# EAGLE design M8320D (EAGLE 6.6.0)
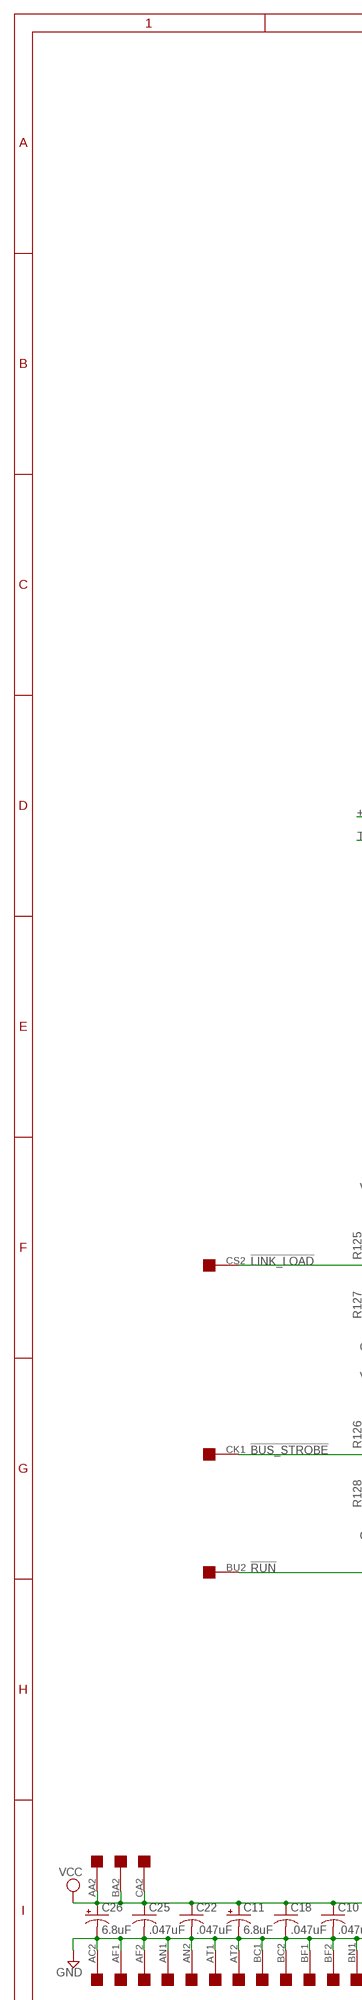
[diagram p0: schematic, sheet 1, part 1 of 2]
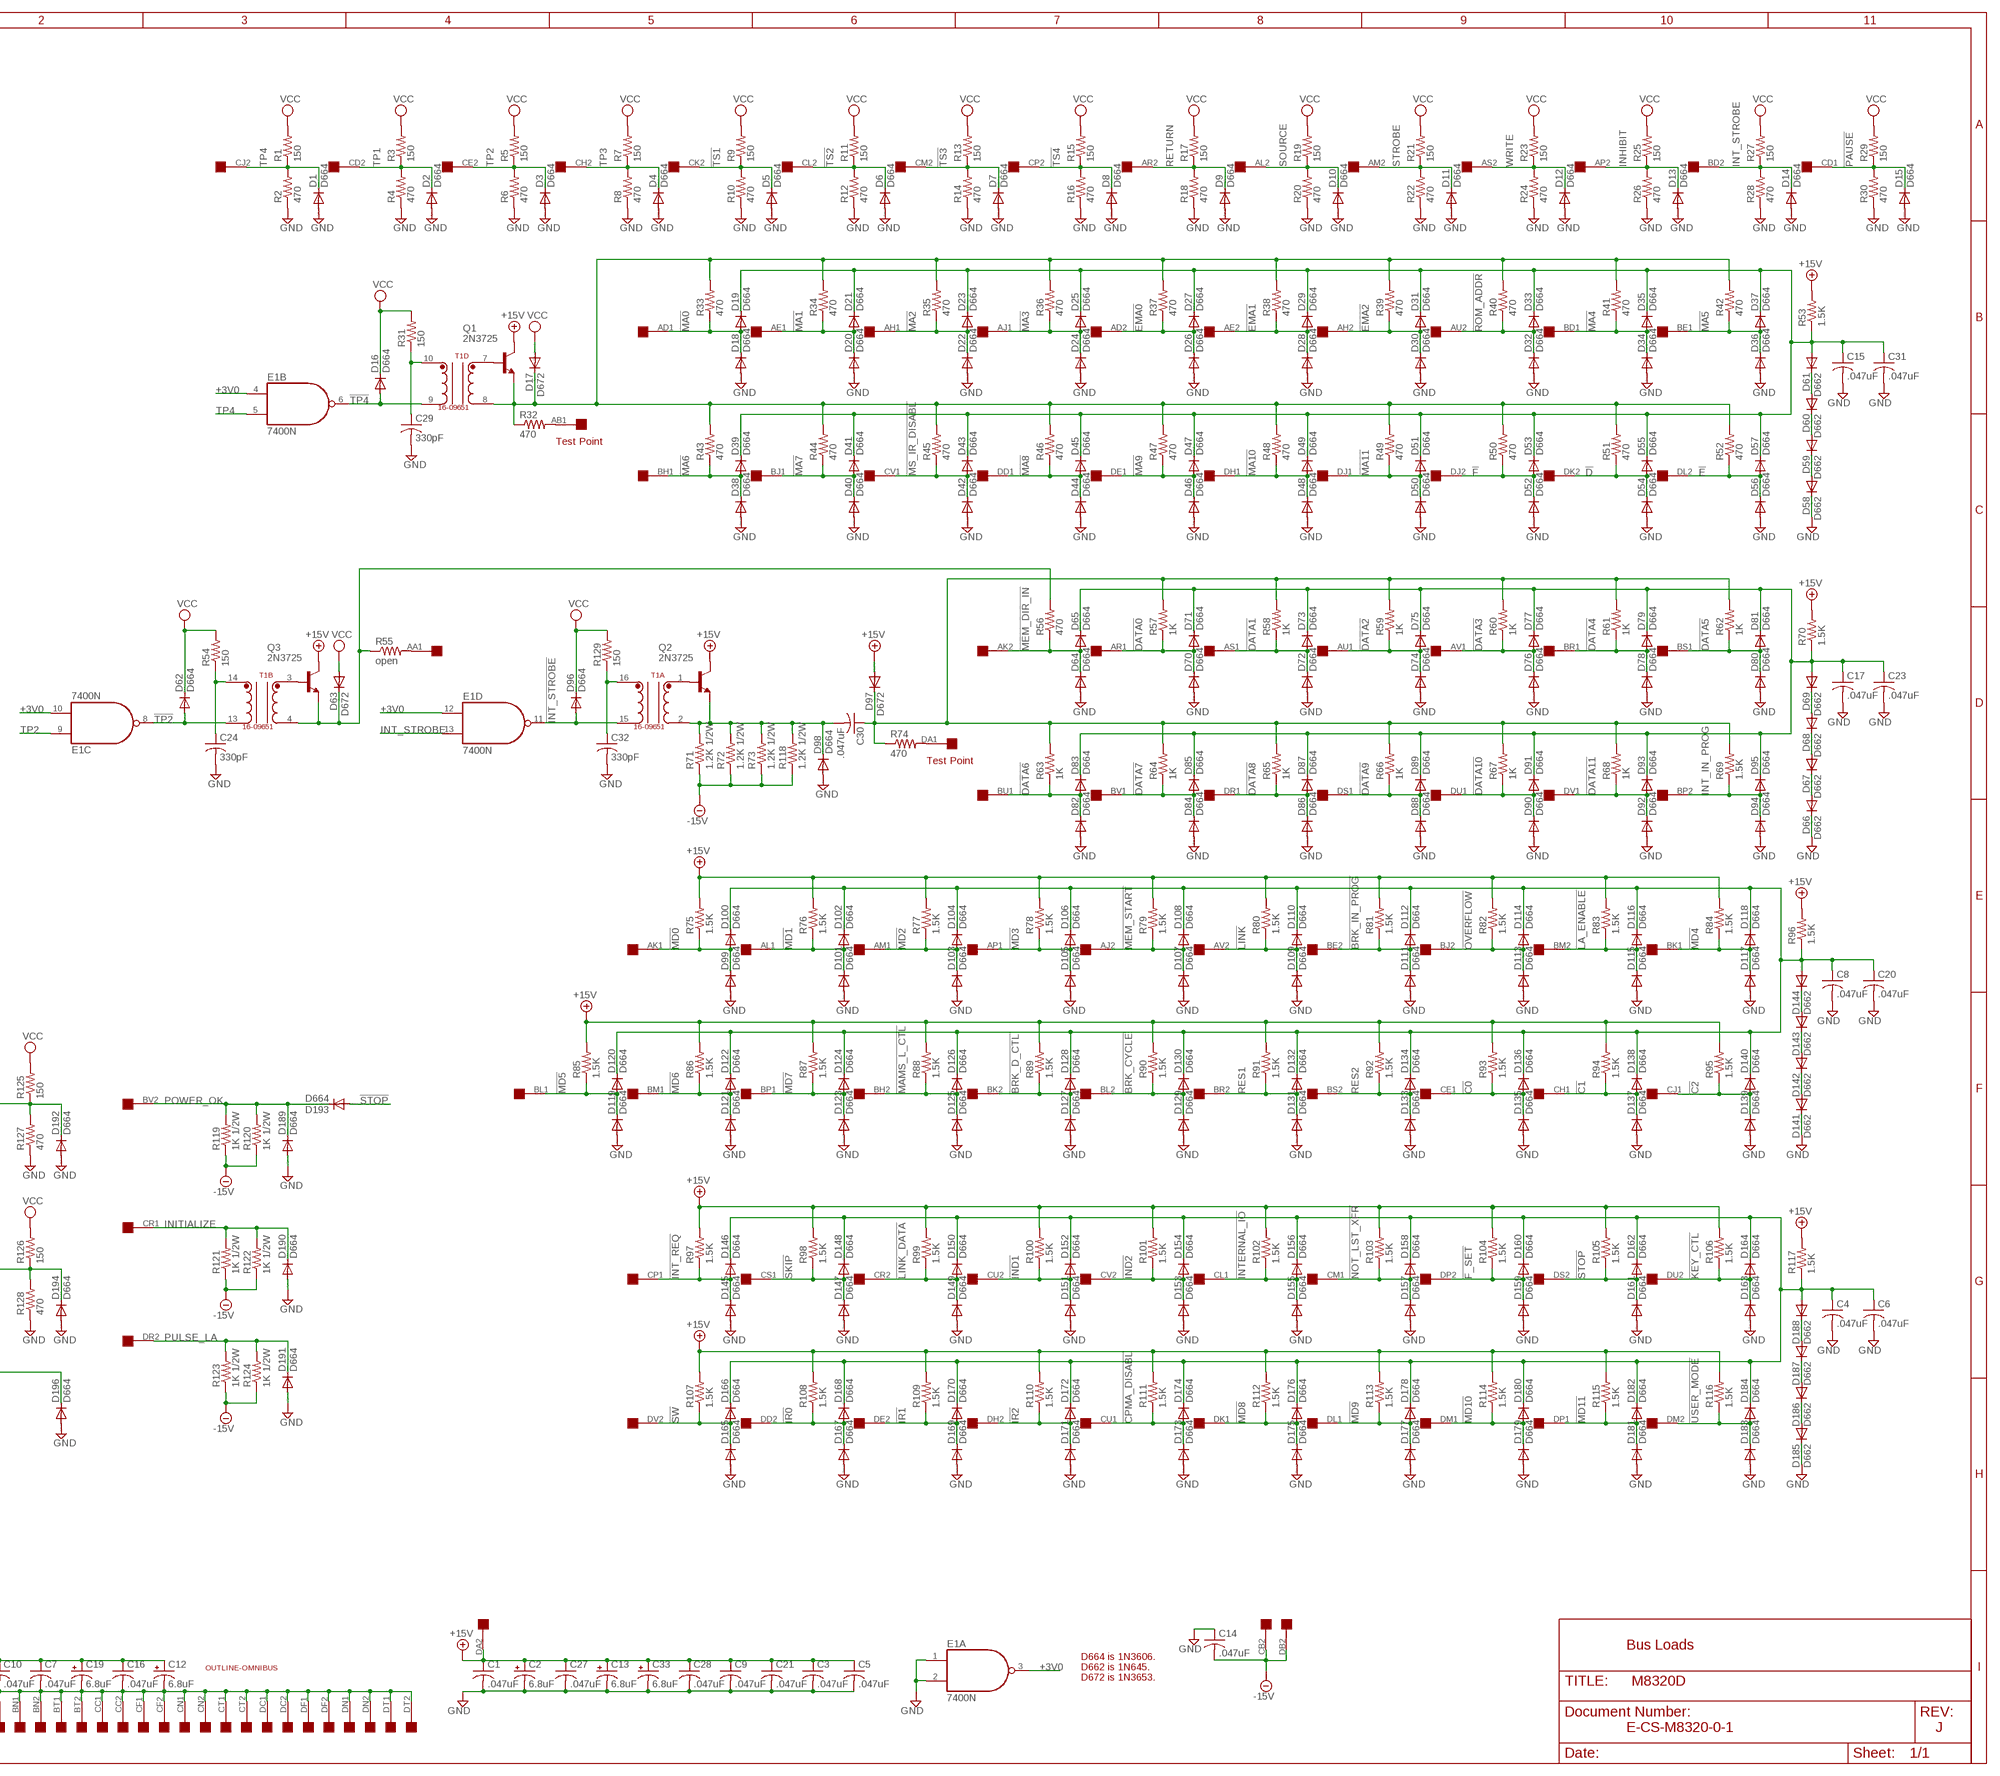
[diagram p1: schematic, sheet 1, part 2 of 2]

## Parts
C1  .047uF  C-US  [C063-025X075]
C2  6.8uF  CPOL-USE20-8AXIAL  [E12-8]
C3  .047uF  C-US  [C063-025X075]
C4  .047uF  C-US  [C063-025X075]
C5  .047uF  C-US  [C063-025X075]
C6  .047uF  C-US  [C063-025X075]
C7  .047uF  C-US  [C063-025X075]
C8  .047uF  C-US  [C063-025X075]
C9  .047uF  C-US  [C063-025X075]
C10  .047uF  C-US  [C063-025X075]
C11  6.8uF  CPOL-USE20-8AXIAL  [E12-8]
C12  6.8uF  CPOL-USE20-8AXIAL  [E12-8]
C13  6.8uF  CPOL-USE20-8AXIAL  [E12-8]
C14  .047uF  C-US  [C063-025X075]
C15  .047uF  C-US  [C063-025X075]
C16  .047uF  C-US  [C063-025X075]
C17  .047uF  C-US  [C063-025X075]
C18  .047uF  C-US  [C063-025X075]
C19  6.8uF  CPOL-USE20-8AXIAL  [E12-8]
C20  .047uF  C-US  [C063-025X075]
C21  .047uF  C-US  [C063-025X075]
C22  .047uF  C-US  [C063-025X075]
C23  .047uF  C-US  [C063-025X075]
C24  330pF  C-US  [C063-025X075]
C25  .047uF  C-US  [C063-025X075]
C26  6.8uF  CPOL-USE20-8AXIAL  [E12-8]
C27  .047uF  C-US  [C063-025X075]
C28  .047uF  C-US  [C063-025X075]
C29  330pF  C-US  [C063-025X075]
C30  .047uF  C-US  [C063-025X075]
C31  .047uF  C-US  [C063-025X075]
C32  330pF  C-US  [C063-025X075]
C33  6.8uF  CPOL-USE20-8AXIAL  [E12-8]
D1  D664  DIODE-DO35-10  [DO35-10]
D2  D664  DIODE-DO35-10  [DO35-10]
D3  D664  DIODE-DO35-10  [DO35-10]
D4  D664  DIODE-DO35-10  [DO35-10]
D5  D664  DIODE-DO35-10  [DO35-10]
D6  D664  DIODE-DO35-10  [DO35-10]
D7  D664  DIODE-DO35-10  [DO35-10]
D8  D664  DIODE-DO35-10  [DO35-10]
D9  D664  DIODE-DO35-10  [DO35-10]
D10  D664  DIODE-DO35-10  [DO35-10]
D11  D664  DIODE-DO35-10  [DO35-10]
D12  D664  DIODE-DO35-10  [DO35-10]
D13  D664  DIODE-DO35-10  [DO35-10]
D14  D664  DIODE-DO35-10  [DO35-10]
D15  D664  DIODE-DO35-10  [DO35-10]
D16  D664  DIODE-DO35-10  [DO35-10]
D17  D672  DIODE-DO35-10  [DO35-10]
D18  D664  DIODE-DO35-10  [DO35-10]
D19  D664  DIODE-DO35-10  [DO35-10]
D20  D664  DIODE-DO35-10  [DO35-10]
D21  D664  DIODE-DO35-10  [DO35-10]
D22  D664  DIODE-DO35-10  [DO35-10]
D23  D664  DIODE-DO35-10  [DO35-10]
D24  D664  DIODE-DO35-10  [DO35-10]
D25  D664  DIODE-DO35-10  [DO35-10]
D26  D664  DIODE-DO35-10  [DO35-10]
D27  D664  DIODE-DO35-10  [DO35-10]
D28  D664  DIODE-DO35-10  [DO35-10]
D29  D664  DIODE-DO35-10  [DO35-10]
D30  D664  DIODE-DO35-10  [DO35-10]
D31  D664  DIODE-DO35-10  [DO35-10]
D32  D664  DIODE-DO35-10  [DO35-10]
D33  D664  DIODE-DO35-10  [DO35-10]
D34  D664  DIODE-DO35-10  [DO35-10]
D35  D664  DIODE-DO35-10  [DO35-10]
D36  D664  DIODE-DO35-10  [DO35-10]
D37  D664  DIODE-DO35-10  [DO35-10]
D38  D664  DIODE-DO35-10  [DO35-10]
D39  D664  DIODE-DO35-10  [DO35-10]
D40  D664  DIODE-DO35-10  [DO35-10]
D41  D664  DIODE-DO35-10  [DO35-10]
D42  D664  DIODE-DO35-10  [DO35-10]
D43  D664  DIODE-DO35-10  [DO35-10]
D44  D664  DIODE-DO35-10  [DO35-10]
D45  D664  DIODE-DO35-10  [DO35-10]
D46  D664  DIODE-DO35-10  [DO35-10]
D47  D664  DIODE-DO35-10  [DO35-10]
D48  D664  DIODE-DO35-10  [DO35-10]
D49  D664  DIODE-DO35-10  [DO35-10]
D50  D664  DIODE-DO35-10  [DO35-10]
D51  D664  DIODE-DO35-10  [DO35-10]
D52  D664  DIODE-DO35-10  [DO35-10]
D53  D664  DIODE-DO35-10  [DO35-10]
D54  D664  DIODE-DO35-10  [DO35-10]
D55  D664  DIODE-DO35-10  [DO35-10]
D56  D664  DIODE-DO35-10  [DO35-10]
D57  D664  DIODE-DO35-10  [DO35-10]
D58  D662  DIODE-DO35-10  [DO35-10]
D59  D662  DIODE-DO35-10  [DO35-10]
D60  D662  DIODE-DO35-10  [DO35-10]
D61  D662  DIODE-DO35-10  [DO35-10]
D62  D664  DIODE-DO35-10  [DO35-10]
D63  D672  DIODE-DO35-10  [DO35-10]
D64  D664  DIODE-DO35-10  [DO35-10]
D65  D664  DIODE-DO35-10  [DO35-10]
D66  D662  DIODE-DO35-10  [DO35-10]
D67  D662  DIODE-DO35-10  [DO35-10]
D68  D662  DIODE-DO35-10  [DO35-10]
D69  D662  DIODE-DO35-10  [DO35-10]
D70  D664  DIODE-DO35-10  [DO35-10]
D71  D664  DIODE-DO35-10  [DO35-10]
D72  D664  DIODE-DO35-10  [DO35-10]
D73  D664  DIODE-DO35-10  [DO35-10]
D74  D664  DIODE-DO35-10  [DO35-10]
D75  D664  DIODE-DO35-10  [DO35-10]
D76  D664  DIODE-DO35-10  [DO35-10]
D77  D664  DIODE-DO35-10  [DO35-10]
D78  D664  DIODE-DO35-10  [DO35-10]
D79  D664  DIODE-DO35-10  [DO35-10]
D80  D664  DIODE-DO35-10  [DO35-10]
D81  D664  DIODE-DO35-10  [DO35-10]
D82  D664  DIODE-DO35-10  [DO35-10]
D83  D664  DIODE-DO35-10  [DO35-10]
D84  D664  DIODE-DO35-10  [DO35-10]
D85  D664  DIODE-DO35-10  [DO35-10]
D86  D664  DIODE-DO35-10  [DO35-10]
D87  D664  DIODE-DO35-10  [DO35-10]
D88  D664  DIODE-DO35-10  [DO35-10]
D89  D664  DIODE-DO35-10  [DO35-10]
D90  D664  DIODE-DO35-10  [DO35-10]
D91  D664  DIODE-DO35-10  [DO35-10]
D92  D664  DIODE-DO35-10  [DO35-10]
D93  D664  DIODE-DO35-10  [DO35-10]
D94  D664  DIODE-DO35-10  [DO35-10]
D95  D664  DIODE-DO35-10  [DO35-10]
D96  D664  DIODE-DO35-10  [DO35-10]
D97  D672  DIODE-DO35-10  [DO35-10]
D98  D664  DIODE-DO35-10  [DO35-10]
D99  D664  DIODE-DO35-10  [DO35-10]
D100  D664  DIODE-DO35-10  [DO35-10]
D101  D664  DIODE-DO35-10  [DO35-10]
D102  D664  DIODE-DO35-10  [DO35-10]
D103  D664  DIODE-DO35-10  [DO35-10]
D104  D664  DIODE-DO35-10  [DO35-10]
D105  D664  DIODE-DO35-10  [DO35-10]
D106  D664  DIODE-DO35-10  [DO35-10]
D107  D664  DIODE-DO35-10  [DO35-10]
D108  D664  DIODE-DO35-10  [DO35-10]
D109  D664  DIODE-DO35-10  [DO35-10]
D110  D664  DIODE-DO35-10  [DO35-10]
D111  D664  DIODE-DO35-10  [DO35-10]
D112  D664  DIODE-DO35-10  [DO35-10]
D113  D664  DIODE-DO35-10  [DO35-10]
D114  D664  DIODE-DO35-10  [DO35-10]
D115  D664  DIODE-DO35-10  [DO35-10]
D116  D664  DIODE-DO35-10  [DO35-10]
D117  D664  DIODE-DO35-10  [DO35-10]
D118  D664  DIODE-DO35-10  [DO35-10]
D119  D664  DIODE-DO35-10  [DO35-10]
D120  D664  DIODE-DO35-10  [DO35-10]
D121  D664  DIODE-DO35-10  [DO35-10]
D122  D664  DIODE-DO35-10  [DO35-10]
D123  D664  DIODE-DO35-10  [DO35-10]
D124  D664  DIODE-DO35-10  [DO35-10]
D125  D664  DIODE-DO35-10  [DO35-10]
D126  D664  DIODE-DO35-10  [DO35-10]
D127  D664  DIODE-DO35-10  [DO35-10]
D128  D664  DIODE-DO35-10  [DO35-10]
D129  D664  DIODE-DO35-10  [DO35-10]
D130  D664  DIODE-DO35-10  [DO35-10]
D131  D664  DIODE-DO35-10  [DO35-10]
D132  D664  DIODE-DO35-10  [DO35-10]
D133  D664  DIODE-DO35-10  [DO35-10]
D134  D664  DIODE-DO35-10  [DO35-10]
D135  D664  DIODE-DO35-10  [DO35-10]
D136  D664  DIODE-DO35-10  [DO35-10]
D137  D664  DIODE-DO35-10  [DO35-10]
D138  D664  DIODE-DO35-10  [DO35-10]
D139  D664  DIODE-DO35-10  [DO35-10]
D140  D664  DIODE-DO35-10  [DO35-10]
D141  D662  DIODE-DO35-10  [DO35-10]
D142  D662  DIODE-DO35-10  [DO35-10]
D143  D662  DIODE-DO35-10  [DO35-10]
D144  D662  DIODE-DO35-10  [DO35-10]
D145  D664  DIODE-DO35-10  [DO35-10]
D146  D664  DIODE-DO35-10  [DO35-10]
D147  D664  DIODE-DO35-10  [DO35-10]
D148  D664  DIODE-DO35-10  [DO35-10]
D149  D664  DIODE-DO35-10  [DO35-10]
D150  D664  DIODE-DO35-10  [DO35-10]
D151  D664  DIODE-DO35-10  [DO35-10]
D152  D664  DIODE-DO35-10  [DO35-10]
D153  D664  DIODE-DO35-10  [DO35-10]
D154  D664  DIODE-DO35-10  [DO35-10]
D155  D664  DIODE-DO35-10  [DO35-10]
D156  D664  DIODE-DO35-10  [DO35-10]
D157  D664  DIODE-DO35-10  [DO35-10]
D158  D664  DIODE-DO35-10  [DO35-10]
D159  D664  DIODE-DO35-10  [DO35-10]
D160  D664  DIODE-DO35-10  [DO35-10]
D161  D664  DIODE-DO35-10  [DO35-10]
D162  D664  DIODE-DO35-10  [DO35-10]
D163  D664  DIODE-DO35-10  [DO35-10]
D164  D664  DIODE-DO35-10  [DO35-10]
D165  D664  DIODE-DO35-10  [DO35-10]
D166  D664  DIODE-DO35-10  [DO35-10]
D167  D664  DIODE-DO35-10  [DO35-10]
D168  D664  DIODE-DO35-10  [DO35-10]
D169  D664  DIODE-DO35-10  [DO35-10]
D170  D664  DIODE-DO35-10  [DO35-10]
D171  D664  DIODE-DO35-10  [DO35-10]
D172  D664  DIODE-DO35-10  [DO35-10]
D173  D664  DIODE-DO35-10  [DO35-10]
D174  D664  DIODE-DO35-10  [DO35-10]
D175  D664  DIODE-DO35-10  [DO35-10]
D176  D664  DIODE-DO35-10  [DO35-10]
D177  D664  DIODE-DO35-10  [DO35-10]
D178  D664  DIODE-DO35-10  [DO35-10]
D179  D664  DIODE-DO35-10  [DO35-10]
D180  D664  DIODE-DO35-10  [DO35-10]
D181  D664  DIODE-DO35-10  [DO35-10]
D182  D664  DIODE-DO35-10  [DO35-10]
D183  D664  DIODE-DO35-10  [DO35-10]
D184  D664  DIODE-DO35-10  [DO35-10]
D185  D662  DIODE-DO35-10  [DO35-10]
D186  D662  DIODE-DO35-10  [DO35-10]
D187  D662  DIODE-DO35-10  [DO35-10]
D188  D662  DIODE-DO35-10  [DO35-10]
D189  D664  DIODE-DO35-10  [DO35-10]
D190  D664  DIODE-DO35-10  [DO35-10]
D191  D664  DIODE-DO35-10  [DO35-10]
D192  D664  DIODE-DO35-10  [DO35-10]
D193  D664  DIODE-DO35-10  [DO35-10]
D194  D664  DIODE-DO35-10  [DO35-10]
D196  D664  DIODE-DO35-10  [DO35-10]
E1  7400N  [DIL14]
Q1  2N3725  -NPN-TO92-EBC  [TO92-EBC]
Q2  2N3725  -NPN-TO92-EBC  [TO92-EBC]
Q3  2N3725  -NPN-TO92-EBC  [TO92-EBC]
R1  150  R-US_0207/10  [0207/10]
R2  470  R-US_0207/10  [0207/10]
R3  150  R-US_0207/10  [0207/10]
R4  470  R-US_0207/10  [0207/10]
R5  150  R-US_0207/10  [0207/10]
R6  470  R-US_0207/10  [0207/10]
R7  150  R-US_0207/10  [0207/10]
R8  470  R-US_0207/10  [0207/10]
R9  150  R-US_0207/10  [0207/10]
R10  470  R-US_0207/10  [0207/10]
R11  150  R-US_0207/10  [0207/10]
R12  470  R-US_0207/10  [0207/10]
R13  150  R-US_0207/10  [0207/10]
R14  470  R-US_0207/10  [0207/10]
R15  150  R-US_0207/10  [0207/10]
R16  470  R-US_0207/10  [0207/10]
R17  150  R-US_0207/10  [0207/10]
R18  470  R-US_0207/10  [0207/10]
R19  150  R-US_0207/10  [0207/10]
R20  470  R-US_0207/10  [0207/10]
R21  150  R-US_0207/10  [0207/10]
R22  470  R-US_0207/10  [0207/10]
R23  150  R-US_0207/10  [0207/10]
R24  470  R-US_0207/10  [0207/10]
R25  150  R-US_0207/10  [0207/10]
R26  470  R-US_0207/10  [0207/10]
R27  150  R-US_0207/10  [0207/10]
R28  470  R-US_0207/10  [0207/10]
R29  150  R-US_0207/10  [0207/10]
R30  470  R-US_0207/10  [0207/10]
R31  150  R-US_0207/10  [0207/10]
R32  470  R-US_0207/10  [0207/10]
R33  470  R-US_0207/10  [0207/10]
R34  470  R-US_0207/10  [0207/10]
R35  470  R-US_0207/10  [0207/10]
R36  470  R-US_0207/10  [0207/10]
R37  470  R-US_0207/10  [0207/10]
R38  470  R-US_0207/10  [0207/10]
R39  470  R-US_0207/10  [0207/10]
R40  470  R-US_0207/10  [0207/10]
R41  470  R-US_0207/10  [0207/10]
R42  470  R-US_0207/10  [0207/10]
R43  470  R-US_0207/10  [0207/10]
R44  470  R-US_0207/10  [0207/10]
R45  470  R-US_0207/10  [0207/10]
R46  470  R-US_0207/10  [0207/10]
R47  470  R-US_0207/10  [0207/10]
R48  470  R-US_0207/10  [0207/10]
R49  470  R-US_0207/10  [0207/10]
R50  470  R-US_0207/10  [0207/10]
R51  470  R-US_0207/10  [0207/10]
R52  470  R-US_0207/10  [0207/10]
R53  1.5K  R-US_0207/10  [0207/10]
R54  150  R-US_0207/10  [0207/10]
R55  open  R-US_0207/10  [0207/10]
R56  470  R-US_0207/10  [0207/10]
R57  1K  R-US_0207/10  [0207/10]
R58  1K  R-US_0207/10  [0207/10]
R59  1K  R-US_0207/10  [0207/10]
R60  1K  R-US_0207/10  [0207/10]
R61  1K  R-US_0207/10  [0207/10]
R62  1K  R-US_0207/10  [0207/10]
R63  1K  R-US_0207/10  [0207/10]
R64  1K  R-US_0207/10  [0207/10]
R65  1K  R-US_0207/10  [0207/10]
R66  1K  R-US_0207/10  [0207/10]
R67  1K  R-US_0207/10  [0207/10]
R68  1K  R-US_0207/10  [0207/10]
R69  1.5K  R-US_0207/10  [0207/10]
R70  1.5K  R-US_0207/10  [0207/10]
R71  1.2K 1/2W  R-US_0411/15  [0411/15]
R72  1.2K 1/2W  R-US_0411/15  [0411/15]
R73  1.2K 1/2W  R-US_0411/15  [0411/15]
R74  470  R-US_0207/10  [0207/10]
R75  1.5K  R-US_0207/10  [0207/10]
R76  1.5K  R-US_0207/10  [0207/10]
R77  1.5K  R-US_0207/10  [0207/10]
R78  1.5K  R-US_0207/10  [0207/10]
R79  1.5K  R-US_0207/10  [0207/10]
R80  1.5K  R-US_0207/10  [0207/10]
R81  1.5K  R-US_0207/10  [0207/10]
R82  1.5K  R-US_0207/10  [0207/10]
R83  1.5K  R-US_0207/10  [0207/10]
R84  1.5K  R-US_0207/10  [0207/10]
R85  1.5K  R-US_0207/10  [0207/10]
R86  1.5K  R-US_0207/10  [0207/10]
R87  1.5K  R-US_0207/10  [0207/10]
R88  1.5K  R-US_0207/10  [0207/10]
R89  1.5K  R-US_0207/10  [0207/10]
R90  1.5K  R-US_0207/10  [0207/10]
R91  1.5K  R-US_0207/10  [0207/10]
R92  1.5K  R-US_0207/10  [0207/10]
R93  1.5K  R-US_0207/10  [0207/10]
R94  1.5K  R-US_0207/10  [0207/10]
R95  1.5K  R-US_0207/10  [0207/10]
R96  1.5K  R-US_0207/10  [0207/10]
R97  1.5K  R-US_0207/10  [0207/10]
R98  1.5K  R-US_0207/10  [0207/10]
R99  1.5K  R-US_0207/10  [0207/10]
R100  1.5K  R-US_0207/10  [0207/10]
R101  1.5K  R-US_0207/10  [0207/10]
R102  1.5K  R-US_0207/10  [0207/10]
R103  1.5K  R-US_0207/10  [0207/10]
R104  1.5K  R-US_0207/10  [0207/10]
R105  1.5K  R-US_0207/10  [0207/10]
R106  1.5K  R-US_0207/10  [0207/10]
R107  1.5K  R-US_0207/10  [0207/10]
R108  1.5K  R-US_0207/10  [0207/10]
R109  1.5K  R-US_0207/10  [0207/10]
R110  1.5K  R-US_0207/10  [0207/10]
R111  1.5K  R-US_0207/10  [0207/10]
R112  1.5K  R-US_0207/10  [0207/10]
R113  1.5K  R-US_0207/10  [0207/10]
R114  1.5K  R-US_0207/10  [0207/10]
R115  1.5K  R-US_0207/10  [0207/10]
R116  1.5K  R-US_0207/10  [0207/10]
R117  1.5K  R-US_0207/10  [0207/10]
R118  1.2K 1/2W  R-US_0411/15  [0411/15]
R119  1K 1/2W  R-US_0411/15  [0411/15]
R120  1K 1/2W  R-US_0411/15  [0411/15]
R121  1K 1/2W  R-US_0411/15  [0411/15]
R122  1K 1/2W  R-US_0411/15  [0411/15]
R123  1K 1/2W  R-US_0411/15  [0411/15]
R124  1K 1/2W  R-US_0411/15  [0411/15]
R125  150  R-US_0207/10  [0207/10]
R126  150  R-US_0207/10  [0207/10]
R127  470  R-US_0207/10  [0207/10]
R128  470  R-US_0207/10  [0207/10]
R129  150  R-US_0207/10  [0207/10]
T1  16-09651  [DIL16]
U$1  OUTLINE-OMNIBUS  [OMNIBUS]
U$2  QUAD  [EDGE-CON8]

## Nets
!BRK_CYCLE: D129.C D130.A R90.1 U$2.BL2
!BRK_D_CTL: D127.C D128.A R89.1 U$2.BK2
!BRK_IN_PROG: D111.C D112.A R81.1 U$2.BE2
!BUS_STROBE: D194.C R126.1 R128.2 U$2.CK1
!C0: D135.C D136.A R93.1 U$2.CE1
!C1: D137.C D138.A R94.1 U$2.CH1
!C2: D139.C D140.A R95.1 U$2.CJ1
!CPMA_DISABL: D173.C D174.A R111.1 U$2.CU1
!D: D54.C D55.A R51.1 U$2.DK2
!DATA0: D70.C D71.A R57.1 U$2.AR1
!DATA1: D72.C D73.A R58.1 U$2.AS1
!DATA2: D74.C D75.A R59.1 U$2.AU1
!DATA3: D76.C D77.A R60.1 U$2.AV1
!DATA4: D78.C D79.A R61.1 U$2.BR1
!DATA5: D80.C D81.A R62.1 U$2.BS1
!DATA6: D82.C D83.A R63.1 U$2.BU1
!DATA7: D84.C D85.A R64.1 U$2.BV1
!DATA8: D86.C D87.A R65.1 U$2.DR1
!DATA9: D88.C D89.A R66.1 U$2.DS1
!DATA10: D90.C D91.A R67.1 U$2.DU1
!DATA11: D92.C D93.A R68.1 U$2.DV1
!E: D56.C D57.A R52.1 U$2.DL2
!EMA0: D26.C D27.A R37.1 U$2.AD2
!EMA1: D28.C D29.A R38.1 U$2.AE2
!EMA2: D30.C D31.A R39.1 U$2.AH2
!F: D52.C D53.A R50.1 U$2.DJ2
!F_SET: D159.C D160.A R104.1 U$2.DP2
!IND1: D151.C D152.A R100.1 U$2.CU2
!IND2: D153.C D154.A R101.1 U$2.CV2
!INT_REQ: D145.C D146.A R97.1 U$2.CP1
!INT_STROBE: D96.A E1.11(D:O) T1.15
!INTERNAL_IO: D155.C D156.A R102.1 U$2.CL1
!IR0: D167.C D168.A R108.1 U$2.DD2
!IR1: D169.C D170.A R109.1 U$2.DE2
!IR2: D171.C D172.A R110.1 U$2.DH2
!KEY_CTL: D163.C D164.A R106.1 U$2.DU2
!LA_ENABLE: D115.C D116.A R83.1 U$2.BM2
!LINK: D109.C D110.A R80.1 U$2.AV2
!LINK_DATA: D149.C D150.A R99.1 U$2.CR2
!LINK_LOAD: D192.C R125.1 R127.2 U$2.CS2
!MA0: D18.C D19.A R33.1 U$2.AD1
!MA1: D20.C D21.A R34.1 U$2.AE1
!MA2: D22.C D23.A R35.1 U$2.AH1
!MA3: D24.C D25.A R36.1 U$2.AJ1
!MA4: D34.C D35.A R41.1 U$2.BD1
!MA5: D36.C D37.A R42.1 U$2.BE1
!MA6: D38.C D39.A R43.1 U$2.BH1
!MA7: D40.C D41.A R44.1 U$2.BJ1
!MA8: D44.C D45.A R46.1 U$2.DD1
!MA9: D46.C D47.A R47.1 U$2.DE1
!MA10: D48.C D49.A R48.1 U$2.DH1
!MA11: D50.C D51.A R49.1 U$2.DJ1
!MAMS_L_CTL: D125.C D126.A R88.1 U$2.BH2
!MD0: D99.C D100.A R75.1 U$2.AK1
!MD1: D101.C D102.A R76.1 U$2.AL1
!MD2: D103.C D104.A R77.1 U$2.AM1
!MD3: D105.C D106.A R78.1 U$2.AP1
!MD4: D117.C D118.A R84.1 U$2.BK1
!MD5: D119.C D120.A R85.1 U$2.BL1
!MD6: D121.C D122.A R86.1 U$2.BM1
!MD7: D123.C D124.A R87.1 U$2.BP1
!MD8: D175.C D176.A R112.1 U$2.DK1
!MD9: D177.C D178.A R113.1 U$2.DL1
!MD10: D179.C D180.A R114.1 U$2.DM1
!MD11: D181.C D182.A R115.1 U$2.DP1
!MEM_DIR_IN: D64.C D65.A R56.1 U$2.AK2
!MEM_START: D107.C D108.A R79.1 U$2.AJ2
!MS_IR_DISABL: D42.C D43.A R45.1 U$2.CV1
!NOT_LST_XFR: D157.C D158.A R103.1 U$2.CM1
!OVERFLOW: D113.C D114.A R82.1 U$2.BJ2
!PAUSE: D15.C R29.1 R30.2 U$2.CD1
!ROM_ADDR: D32.C D33.A R40.1 U$2.AU2
!RUN: D196.C U$2.BU2
!SKIP: D147.C D148.A R98.1 U$2.CS1
!STOP: D161.C D162.A D193.A R105.1 U$2.DS2
!SW: D165.C D166.A R107.1 U$2.DV2
!TP2: D62.A E1.8(C:O) T1.13
!TP4: D16.A E1.6(B:O) T1.9
!TS1: D5.C R9.1 R10.2 U$2.CK2
!TS2: D6.C R11.1 R12.2 U$2.CL2
!TS3: D7.C R13.1 R14.2 U$2.CM2
!TS4: D8.C R15.1 R16.2 U$2.CP2
!USER_MODE: D183.C D184.A R116.1 U$2.DM2
+3V0: E1.3(A:O) E1.4(B:I0) E1.10(C:I1) E1.12(D:I0)
+15V: C1.1 C2.+ C3.1 C5.1 C9.1 C13.+ C21.1 C27.1 C28.1 C33.+ D97.A Q1.C Q2.C Q3.C R53.2 R70.2 R75.2 R76.2 R77.2 R78.2 R79.2 R80.2 R81.2 R82.2 R83.2 R84.2 R85.2 R86.2 R87.2 R88.2 R89.2 R90.2 R91.2 R92.2 R93.2 R94.2 R95.2 R96.2 R97.2 R98.2 R99.2 R100.2 R101.2 R102.2 R103.2 R104.2 R105.2 R106.2 R107.2 R108.2 R109.2 R110.2 R111.2 R112.2 R113.2 R114.2 R115.2 R116.2 R117.2 U$2.DA2
-15V: C14.2 R71.1 R72.1 R73.1 R118.1 R119.1 R120.1 R121.1 R122.1 R123.1 R124.1 U$2.CB2 U$2.DB2
GND: C1.2 C2.- C3.2 C4.2 C5.2 C6.2 C7.2 C8.2 C9.2 C10.2 C11.- C12.- C13.- C14.1 C15.2 C16.2 C17.2 C18.2 C19.- C20.2 C21.2 C22.2 C23.2 C24.2 C25.2 C26.- C27.2 C28.2 C29.2 C31.2 C32.2 C33.- D1.A D2.A D3.A D4.A D5.A D6.A D7.A D8.A D9.A D10.A D11.A D12.A D13.A D14.A D15.A D18.A D20.A D22.A D24.A D26.A D28.A D30.A D32.A D34.A D36.A D38.A D40.A D42.A D44.A D46.A D48.A D50.A D52.A D54.A D56.A D58.C D64.A D66.C D70.A D72.A D74.A D76.A D78.A D80.A D82.A D84.A D86.A D88.A D90.A D92.A D94.A D98.A D99.A D101.A D103.A D105.A D107.A D109.A D111.A D113.A D115.A D117.A D119.A D121.A D123.A D125.A D127.A D129.A D131.A D133.A D135.A D137.A D139.A D141.C D145.A D147.A D149.A D151.A D153.A D155.A D157.A D159.A D161.A D163.A D165.A D167.A D169.A D171.A D173.A D175.A D177.A D179.A D181.A D183.A D185.C D189.A D190.A D191.A D192.A D194.A D196.A E1.1(A:I0) E1.2(A:I1) R2.1 R4.1 R6.1 R8.1 R10.1 R12.1 R14.1 R16.1 R18.1 R20.1 R22.1 R24.1 R26.1 R28.1 R30.1 R127.1 R128.1 U$2.AC2 U$2.AF1 U$2.AF2 U$2.AN1 U$2.AN2 U$2.AT1 U$2.AT2 U$2.BC1 U$2.BC2 U$2.BF1 U$2.BF2 U$2.BN1 U$2.BN2 U$2.BT1 U$2.BT2 U$2.CC1 U$2.CC2 U$2.CF1 U$2.CF2 U$2.CN1 U$2.CN2 U$2.CT1 U$2.CT2 U$2.DC1 U$2.DC2 U$2.DF1 U$2.DF2 U$2.DN1 U$2.DN2 U$2.DT1 U$2.DT2
INHIBIT: D13.C R25.1 R26.2 U$2.AP2
INITIALIZE: D190.C R121.2 R122.2 U$2.CR1
INT_IN_PROG: D94.C D95.A R69.1 U$2.BP2
INT_STROBE: D14.C E1.13(D:I1) R27.1 R28.2 U$2.BD2
N$1: D58.A D59.C
N$2: D59.A D60.C
N$3: D60.A D61.C
N$4: C24.1 R54.1 T1.14
N$5: Q3.B T1.3
N$6: C30.1 D97.C R57.2 R58.2 R59.2 R60.2 R61.2 R62.2 R63.2 R64.2 R65.2 R66.2 R67.2 R68.2 R69.2 R74.1
N$7: C32.1 R129.1 T1.16
N$8: Q2.B T1.1
N$9: C15.1 C31.1 D19.C D21.C D23.C D25.C D27.C D29.C D31.C D33.C D35.C D37.C D39.C D41.C D43.C D45.C D47.C D49.C D51.C D53.C D55.C D57.C D61.A R53.1
N$10: D66.A D67.C
N$11: D67.A D68.C
N$12: D68.A D69.C
N$13: C17.1 C23.1 D65.C D69.A D71.C D73.C D75.C D77.C D79.C D81.C D83.C D85.C D87.C D89.C D91.C D93.C D95.C R70.1
N$14: C30.2 D98.C Q2.E R71.2 R72.2 R73.2 R118.2 T1.2
N$15: D63.C Q3.E R55.1 R56.2 T1.4
N$16: R74.2 U$2.DA1
N$17: D185.A D186.C
N$18: D141.A D142.C
N$19: D142.A D143.C
N$20: D143.A D144.C
N$21: C29.1 R31.1 T1.10
N$22: Q1.B T1.7
N$23: D17.C Q1.E R32.1 R33.2 R34.2 R35.2 R36.2 R37.2 R38.2 R39.2 R40.2 R41.2 R42.2 R43.2 R44.2 R45.2 R46.2 R47.2 R48.2 R49.2 R50.2 R51.2 R52.2 T1.8
N$24: R32.2 U$2.AB1
N$25: C8.1 C20.1 D100.C D102.C D104.C D106.C D108.C D110.C D112.C D114.C D116.C D118.C D120.C D122.C D124.C D126.C D128.C D130.C D132.C D134.C D136.C D138.C D140.C D144.A R96.1
N$26: D186.A D187.C
N$27: D187.A D188.C
N$28: C4.1 C6.1 D146.C D148.C D150.C D152.C D154.C D156.C D158.C D160.C D162.C D164.C D166.C D168.C D170.C D172.C D174.C D176.C D178.C D180.C D182.C D184.C D188.A R117.1
N$35: R55.2 U$2.AA1
POWER_OK: D189.C D193.C R119.2 R120.2 U$2.BV2
PULSE_LA: D191.C R123.2 R124.2 U$2.DR2
RES1: D131.C D132.A R91.1 U$2.BR2
RES2: D133.C D134.A R92.1 U$2.BS2
RETURN: D9.C R17.1 R18.2 U$2.AR2
SOURCE: D10.C R19.1 R20.2 U$2.AL2
STROBE: D11.C R21.1 R22.2 U$2.AM2
TP1: D2.C R3.1 R4.2 U$2.CD2
TP2: D3.C E1.9(C:I0) R5.1 R6.2 U$2.CE2
TP3: D4.C R7.1 R8.2 U$2.CH2
TP4: D1.C E1.5(B:I1) R1.1 R2.2 U$2.CJ2
VCC: C7.1 C10.1 C11.+ C12.+ C16.1 C18.1 C19.+ C22.1 C25.1 C26.+ D16.C D17.A D62.C D63.A D96.C R1.2 R3.2 R5.2 R7.2 R9.2 R11.2 R13.2 R15.2 R17.2 R19.2 R21.2 R23.2 R25.2 R27.2 R29.2 R31.2 R54.2 R125.2 R126.2 R129.2 U$2.AA2 U$2.BA2 U$2.CA2
WRITE: D12.C R23.1 R24.2 U$2.AS2
Unconnected: T1.5 T1.6 T1.11 T1.12 U$2.AB2 U$2.AC1 U$2.BA1 U$2.BB1 U$2.BB2 U$2.CA1 U$2.CB1 U$2.DB1

## Notes on the sheet
- Test Point
- Test Point
- Bus Loads
- D664 is 1N3606.
- D662 is 1N645.
- D672 is 1N3653.
- E-CS-M8320-0-1 | J

## Power pins joined to a net without a drawn wire
GND: E1.7(P:GND)
VCC: E1.14(P:VCC)

## Library data of the parts
C1 C3-C10 C14-C18 C20-C25 C27-C32 = dec-con:C-US: Capacitors with funky DEC lead spacing.
C2 C11-C13 C19 C26 C33 = dec-con:CPOL-USE20-8AXIAL: A 0.8 inch electrolytic.
D1-D194 D196 = diode:DIODE-: DIODE
E1 = 74xx-us:74*00: Quad 2-input NAND gate
Q1-Q3 = transistor:*-NPN-: NPN Transistror BF959 corrected 2008.03.06
R1-R129 = rcl:R-US_: RESISTOR, American symbol
T1 = dec-con:16-09651: DIP-16 Quad Pulse Transformer
U$1 = dec-con:OUTLINE-*: Board outlines for DEC boards.
U$2 = dec-con:QUAD: Quad-Height DEC board

## Board
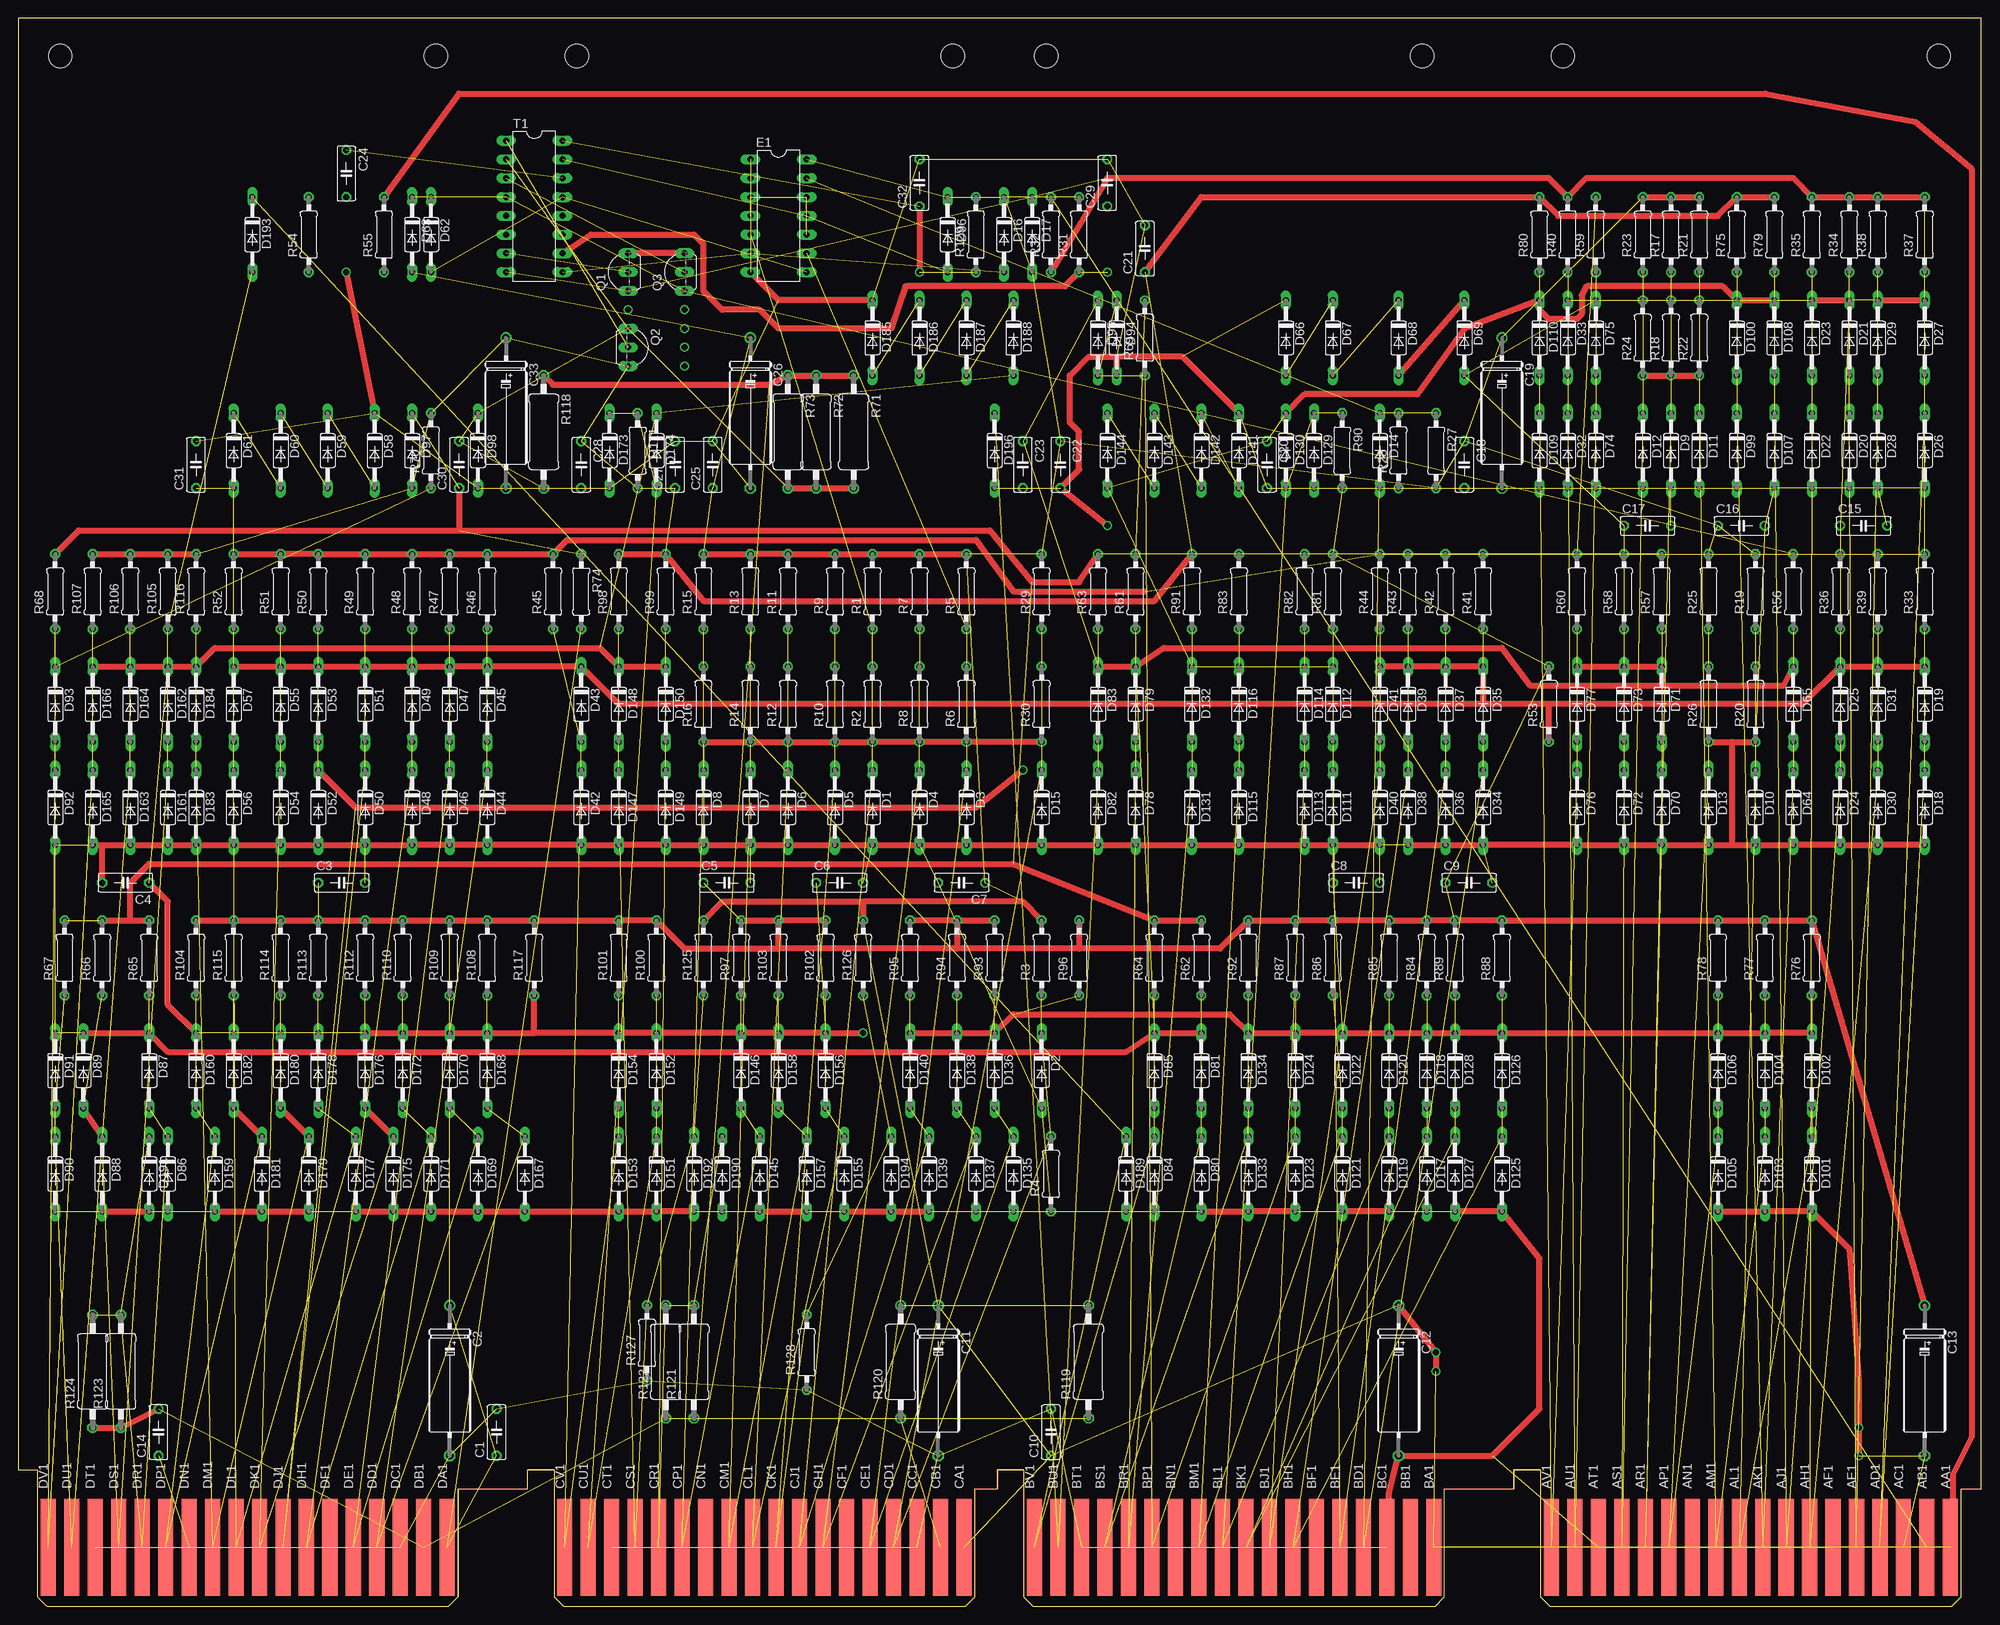
[diagram p2: board, top side]
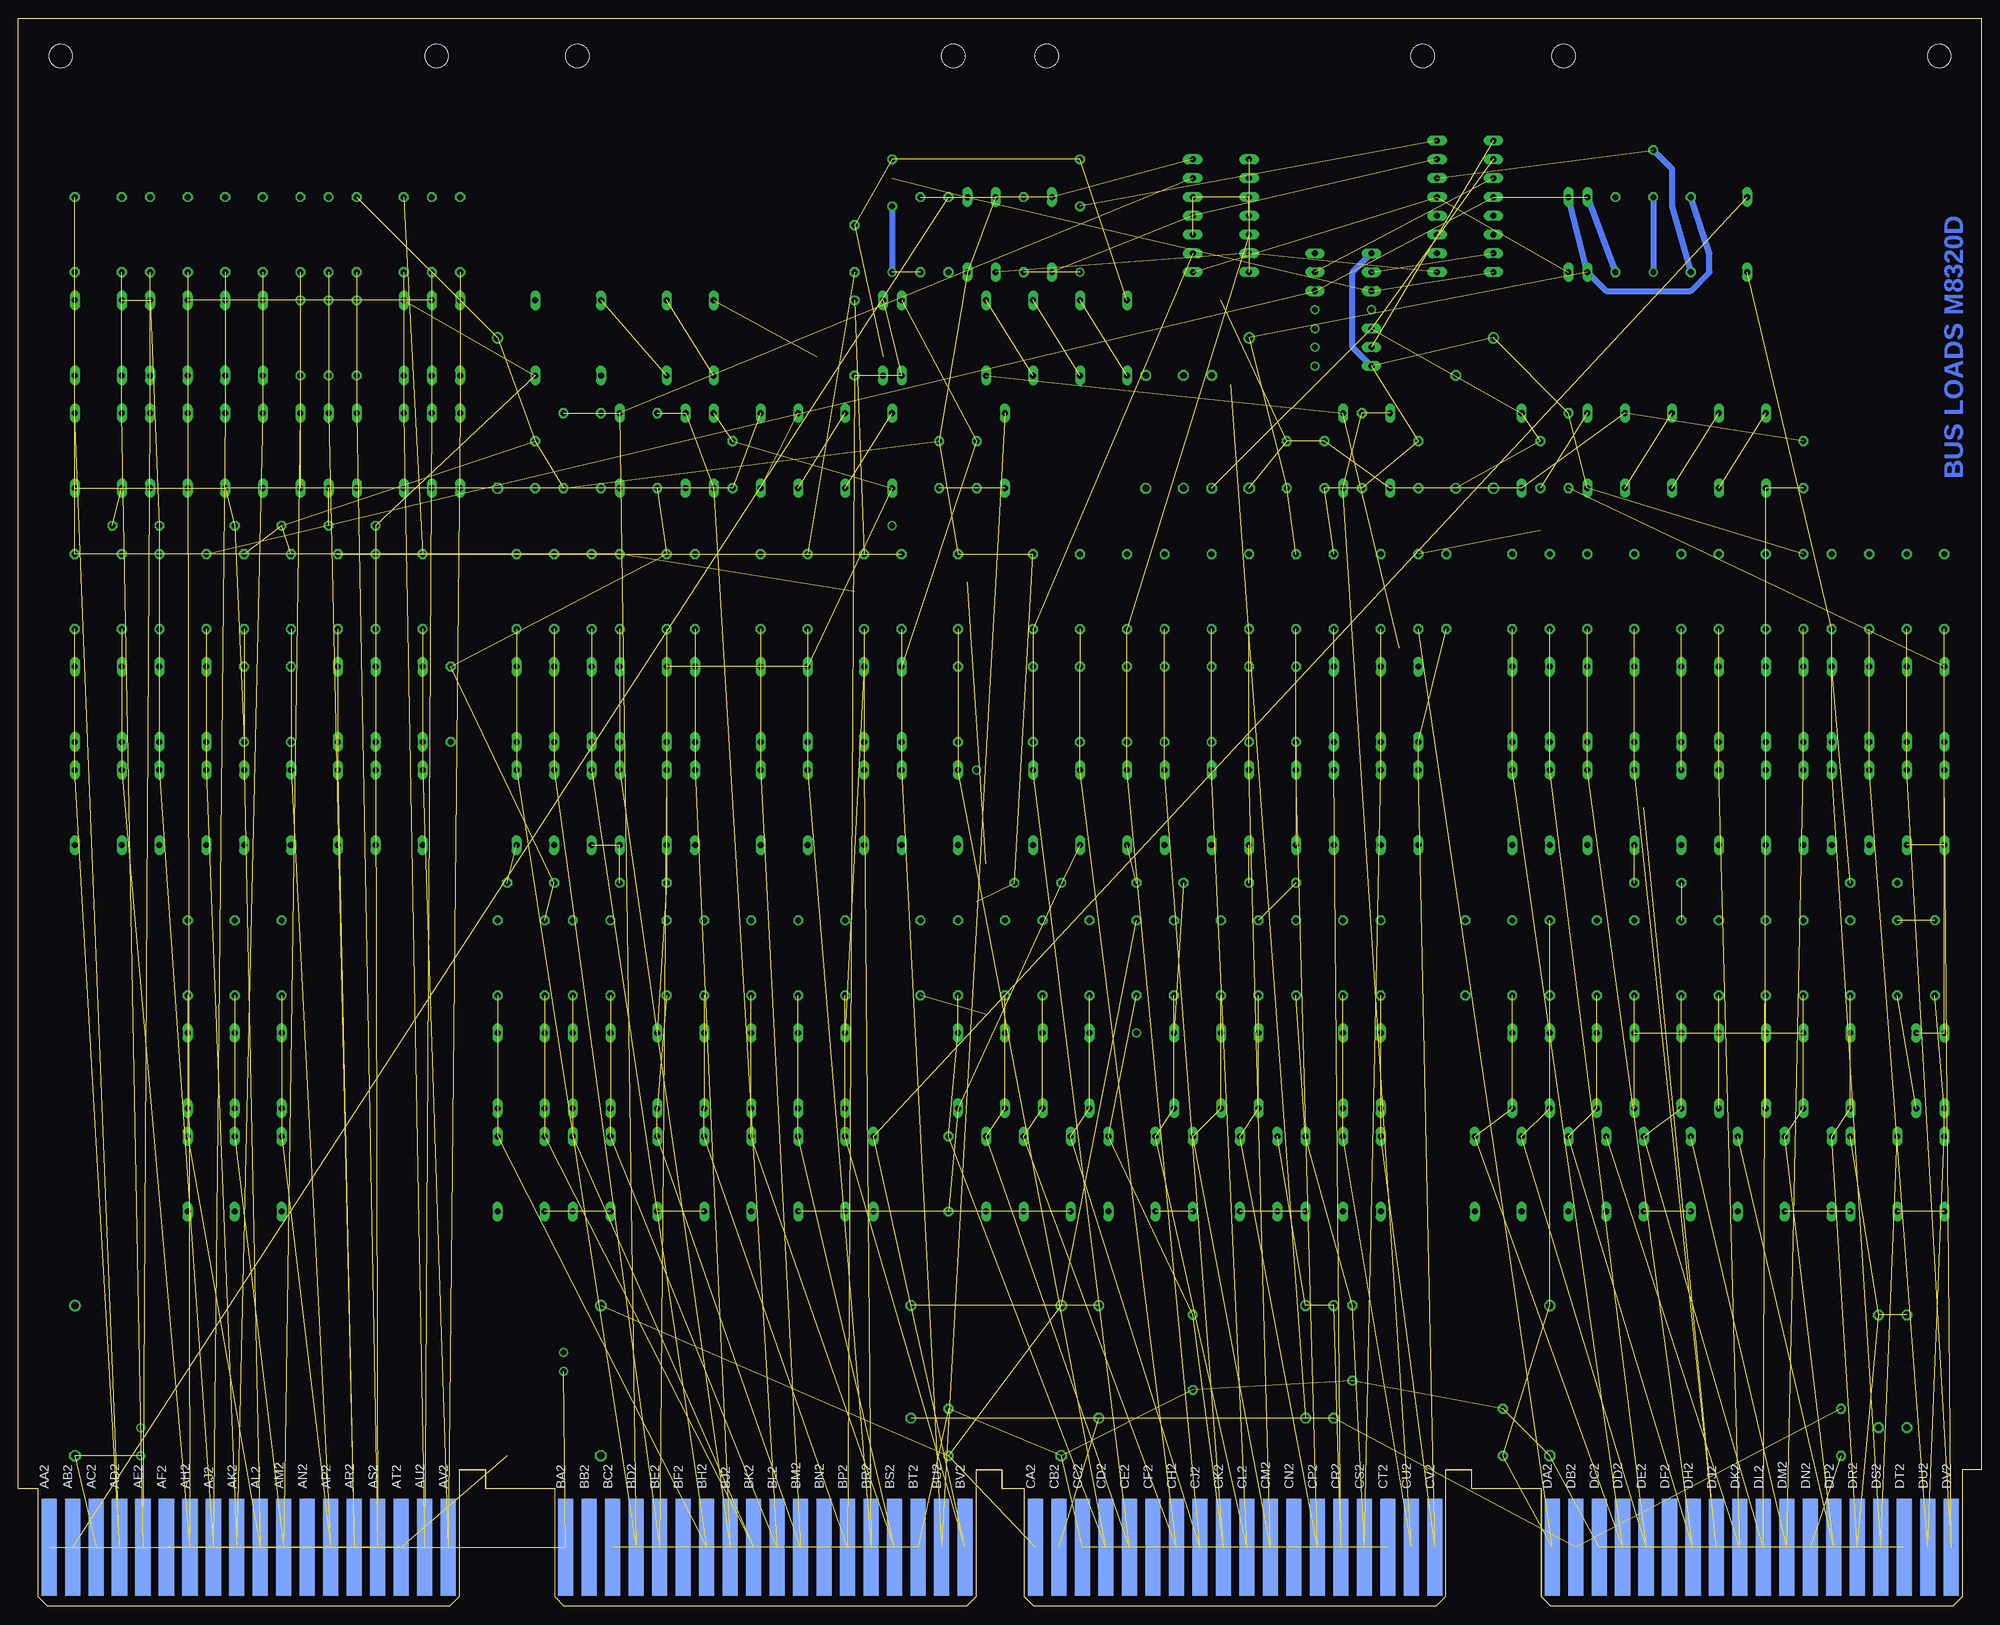
[diagram p3: board, bottom side, seen from below]

Size 265.3 x 214.63 mm. Coordinates in mm from the lower left corner, seen from the top.
Copper layers (1+16): Top 0.035mm / dielectric 1.5mm / Bottom 0.035mm
Design rules "16mils": minimum track width 16mil, minimum drill 32mil, track to track 15mil, track to pad 10mil, pad to pad 10mil, via to via 10mil, smd to smd 10mil, copper to edge 13mil, drill to drill 10mil, minimum pad ring 10mil, minimum via ring 8mil, stop-mask expansion 0mil, vias tented up to drill 0mil, thermal gap 10mil

### Footprints (pad centres in the part's own frame; a part is rotated, then mirrored left to right if it is on the bottom)
C063-025X075 = drill 0.813 octagon: 1 -2.54,0; 2 3.81,0
E12-8 = drill 1.016: + -10.16,0 | drill 1.016 octagon: - 10.16,0
DO35-10 = drill 0.813 long: A 5.08,0; C -5.08,0
DIL14 = drill 0.813 long: 1 -7.62,-3.81; 2 -5.08,-3.81; 3 -2.54,-3.81; 4 0,-3.81; 5 2.54,-3.81; 6 5.08,-3.81; 7 7.62,-3.81; 8 7.62,3.81; 9 5.08,3.81; 10 2.54,3.81; 11 0,3.81; 12 -2.54,3.81; 13 -5.08,3.81; 14 -7.62,3.81
TO92-EBC = drill 0.813 long: B 0,-1.27; C 2.54,-1.27; E -2.54,-1.27
0207/10 = drill 0.813 octagon: 1 -5.08,0; 2 5.08,0
0411/15 = drill 0.914 octagon: 1 -7.62,0; 2 7.62,0
DIL16 = drill 0.813 long: 1 -8.89,-3.81; 2 -6.35,-3.81; 3 -3.81,-3.81; 4 -1.27,-3.81; 5 1.27,-3.81; 6 3.81,-3.81; 7 6.35,-3.81; 8 8.89,-3.81; 9 8.89,3.81; 10 6.35,3.81; 11 3.81,3.81; 12 1.27,3.81; 13 -1.27,3.81; 14 -3.81,3.81; 15 -6.35,3.81; 16 -8.89,3.81
OMNIBUS = hole 3.175: 208.915,209.55; 259.715,209.55; 189.865,209.55; 139.065,209.55; 75.616,209.55; 126.416,209.55; 56.566,209.55; 5.766,209.55
EDGE-CON8 = smd 2.032 x 13.106: AA1 261.303,7.938; AB1 258.127,7.938; AC1 254.952,7.938; AD1 251.778,7.938; AE1 248.602,7.938; AF1 245.428,7.938; AH1 242.252,7.938; AJ1 239.077,7.938; AK1 235.903,7.938; AL1 232.727,7.938; AM1 229.553,7.938; AN1 226.377,7.938; AP1 223.202,7.938; AR1 220.028,7.938; AS1 216.852,7.938; AT1 213.678,7.938; AU1 210.502,7.938; AV1 207.327,7.938; BA1 191.452,7.938; BB1 188.278,7.938; BC1 185.102,7.938; BD1 181.928,7.938; BE1 178.752,7.938; BF1 175.577,7.938; BH1 172.403,7.938; BJ1 169.227,7.938; BK1 166.053,7.938; BL1 162.877,7.938; BM1 159.702,7.938; BN1 156.528,7.938; BP1 153.352,7.938; BR1 150.178,7.938; BS1 147.002,7.938; BT1 143.827,7.938; BU1 140.653,7.938; BV1 137.477,7.938; CA1 127.953,7.938; CB1 124.778,7.938; CC1 121.603,7.938; CD1 118.427,7.938; CE1 115.252,7.938; CF1 112.078,7.938; CH1 108.903,7.938; CJ1 105.728,7.938; CK1 102.552,7.938; CL1 99.377,7.938; CM1 96.203,7.938; CN1 93.028,7.938; CP1 89.853,7.938; CR1 86.677,7.938; CS1 83.502,7.938; CT1 80.328,7.938; CU1 77.153,7.938; CV1 73.978,7.938; DA1 58.102,7.938; DB1 54.928,7.938; DC1 51.752,7.938; DD1 48.578,7.938; DE1 45.403,7.938; DF1 42.227,7.938; DH1 39.053,7.938; DJ1 35.877,7.938; DK1 32.703,7.938; DL1 29.527,7.938; DM1 26.352,7.938; DN1 23.177,7.938; DP1 20.003,7.938; DR1 16.828,7.938; DS1 13.652,7.938; DT1 10.477,7.938; DU1 7.303,7.938; DV1 4.128,7.938 | smd 2.032 x 13.106 bottom: AA2 261.303,7.938; AB2 258.127,7.938; AC2 254.952,7.938; AD2 251.778,7.938; AE2 248.602,7.938; AF2 245.428,7.938; AH2 242.252,7.938; AJ2 239.077,7.938; AK2 235.903,7.938; AL2 232.727,7.938; AM2 229.553,7.938; AN2 226.377,7.938; AP2 223.202,7.938; AR2 220.028,7.938; AS2 216.852,7.938; AT2 213.678,7.938; AU2 210.502,7.938; AV2 207.327,7.938; BA2 191.452,7.938; BB2 188.278,7.938; BC2 185.102,7.938; BD2 181.928,7.938; BE2 178.752,7.938; BF2 175.577,7.938; BH2 172.403,7.938; BJ2 169.227,7.938; BK2 166.053,7.938; BL2 162.877,7.938; BM2 159.702,7.938; BN2 156.528,7.938; BP2 153.352,7.938; BR2 150.178,7.938; BS2 147.002,7.938; BT2 143.827,7.938; BU2 140.653,7.938; BV2 137.477,7.938; CA2 127.953,7.938; CB2 124.778,7.938; CC2 121.603,7.938; CD2 118.427,7.938; CE2 115.252,7.938; CF2 112.078,7.938; CH2 108.903,7.938; CJ2 105.728,7.938; CK2 102.552,7.938; CL2 99.377,7.938; CM2 96.203,7.938; CN2 93.028,7.938; CP2 89.853,7.938; CR2 86.677,7.938; CS2 83.502,7.938; CT2 80.328,7.938; CU2 77.153,7.938; CV2 73.978,7.938; DA2 58.102,7.938; DB2 54.928,7.938; DC2 51.752,7.938; DD2 48.578,7.938; DE2 45.403,7.938; DF2 42.227,7.938; DH2 39.053,7.938; DJ2 35.877,7.938; DK2 32.703,7.938; DL2 29.527,7.938; DM2 26.352,7.938; DN2 23.177,7.938; DP2 20.003,7.938; DR2 16.828,7.938; DS2 13.652,7.938; DT2 10.477,7.938; DU2 7.303,7.938; DV2 4.128,7.938

### Placement (x,y rotation side)
C1  64.64,22.86 90 top
C2  58.29,30.48 270 top
C3  43.05,97.79 0 top
C4  15.11,97.79 180 top
C5  95.12,97.79 0 top
C6  110.36,97.79 0 top
C7  128.14,97.79 180 top
C8  180.21,97.79 0 top
C9  195.45,97.79 0 top
C10  139.57,22.86 90 top
C11  124.33,30.48 270 top
C12  186.56,30.48 270 top
C13  257.68,30.48 270 top
C14  18.92,22.86 90 top
C15  248.79,146.05 0 top
C16  232.28,146.05 0 top
C17  219.58,146.05 0 top
C18  195.45,154.94 270 top
C19  200.53,161.29 270 top
C20  168.78,154.94 270 top
C21  152.27,182.88 90 top
C22  140.84,154.94 270 top
C23  135.76,154.94 270 top
C24  44.32,194.31 270 top
C25  93.85,153.67 90 top
C26  98.93,161.29 270 top
C27  88.77,153.67 90 top
C28  76.07,154.94 270 top
C29  147.19,191.77 90 top
C30  59.56,153.67 90 top
C31  24,153.67 90 top
C32  121.79,191.77 90 top
C33  65.91,161.29 270 top
D1  115.44,107.95 270 top
D2  138.3,72.39 270 top
D3  128.14,107.95 270 top
D4  121.79,107.95 270 top
D5  110.36,107.95 270 top
D6  104.01,107.95 270 top
D7  98.93,107.95 270 top
D8  92.58,107.95 270 top
D9  223.39,156.21 270 top
D10  234.82,107.95 270 top
D11  227.2,156.21 270 top
D12  219.58,156.21 270 top
D13  228.47,107.95 270 top
D14  184.02,156.21 270 top
D15  138.3,107.95 270 top
D16  133.22,185.42 270 top
D17  137.03,185.42 270 top
D18  257.68,107.95 270 top
D19  257.68,121.92 270 top
D20  247.52,156.21 270 top
D21  247.52,171.45 270 top
D22  242.44,156.21 270 top
D23  242.44,171.45 270 top
D24  246.25,107.95 270 top
D25  246.25,121.92 270 top
D26  257.68,156.21 270 top
D27  257.68,171.45 270 top
D28  251.33,156.21 270 top
D29  251.33,171.45 270 top
D30  251.33,107.95 270 top
D31  251.33,121.92 270 top
D32  209.42,156.21 270 top
D33  209.42,171.45 270 top
D34  197.99,107.95 270 top
D35  197.99,121.92 270 top
D36  192.91,107.95 270 top
D37  192.91,121.92 270 top
D38  187.83,107.95 270 top
D39  187.83,121.92 270 top
D40  184.02,107.95 270 top
D41  184.02,121.92 270 top
D42  76.07,107.95 270 top
D43  76.07,121.92 270 top
D44  63.37,107.95 270 top
D45  63.37,121.92 270 top
D46  58.29,107.95 270 top
D47  58.29,121.92 270 top
D48  53.21,107.95 270 top
D49  53.21,121.92 270 top
D50  46.86,107.95 270 top
D51  46.86,121.92 270 top
D52  40.51,107.95 270 top
D53  40.51,121.92 270 top
D54  35.43,107.95 270 top
D55  35.43,121.92 270 top
D56  29.08,107.95 270 top
D57  29.08,121.92 270 top
D58  48.13,156.21 270 top
D59  41.78,156.21 270 top
D60  35.43,156.21 270 top
D61  29.08,156.21 270 top
D62  55.75,185.42 270 top
D63  53.21,185.42 270 top
D64  239.9,107.95 270 top
D65  239.9,121.92 270 top
D66  171.32,171.45 270 top
D67  177.67,171.45 270 top
D68  186.56,171.45 270 top
D69  195.45,171.45 270 top
D70  222.12,107.95 270 top
D71  222.12,121.92 270 top
D72  217.04,107.95 270 top
D73  217.04,121.92 270 top
D74  213.23,156.21 270 top
D75  213.23,171.45 270 top
D76  210.69,107.95 270 top
D77  210.69,121.92 270 top
D78  151,107.95 270 top
D79  151,121.92 270 top
D80  159.89,58.42 270 top
D81  159.89,72.39 270 top
D82  145.92,107.95 270 top
D83  145.92,121.92 270 top
D84  153.54,58.42 270 top
D85  153.54,72.39 270 top
D86  20.19,58.42 270 top
D87  17.65,72.39 270 top
D88  11.3,58.42 270 top
D89  8.76,72.39 270 top
D90  4.95,58.42 270 top
D91  4.95,72.39 270 top
D92  4.95,107.95 270 top
D93  4.95,121.92 270 top
D94  148.46,171.45 270 top
D95  145.92,171.45 270 top
D96  125.6,185.42 270 top
D97  53.21,156.21 270 top
D98  62.1,156.21 270 top
D99  232.28,156.21 270 top
D100  232.28,171.45 270 top
D101  242.44,58.42 270 top
D102  242.44,72.39 270 top
D103  236.09,58.42 270 top
D104  236.09,72.39 270 top
D105  229.74,58.42 270 top
D106  229.74,72.39 270 top
D107  237.36,156.21 270 top
D108  237.36,171.45 270 top
D109  205.61,156.21 270 top
D110  205.61,171.45 270 top
D111  177.67,107.95 270 top
D112  177.67,121.92 270 top
D113  173.86,107.95 270 top
D114  173.86,121.92 270 top
D115  164.97,107.95 270 top
D116  164.97,121.92 270 top
D117  190.37,58.42 270 top
D118  190.37,72.39 270 top
D119  185.29,58.42 270 top
D120  185.29,72.39 270 top
D121  178.94,58.42 270 top
D122  178.94,72.39 270 top
D123  172.59,58.42 270 top
D124  172.59,72.39 270 top
D125  200.53,58.42 270 top
D126  200.53,72.39 270 top
D127  194.18,58.42 270 top
D128  194.18,72.39 270 top
D129  175.13,156.21 270 top
D130  171.32,156.21 270 top
D131  158.62,107.95 270 top
D132  158.62,121.92 270 top
D133  166.24,58.42 270 top
D134  166.24,72.39 270 top
D135  134.49,58.42 270 top
D136  131.95,72.39 270 top
D137  129.41,58.42 270 top
D138  126.87,72.39 270 top
D139  123.06,58.42 270 top
D140  120.52,72.39 270 top
D141  164.97,156.21 270 top
D142  159.89,156.21 270 top
D143  153.54,156.21 270 top
D144  147.19,156.21 270 top
D145  100.2,58.42 270 top
D146  97.66,72.39 270 top
D147  81.15,107.95 270 top
D148  81.15,121.92 270 top
D149  87.5,107.95 270 top
D150  87.5,121.92 270 top
D151  86.23,58.42 270 top
D152  86.23,72.39 270 top
D153  81.15,58.42 270 top
D154  81.15,72.39 270 top
D155  111.63,58.42 270 top
D156  109.09,72.39 270 top
D157  106.55,58.42 270 top
D158  102.74,72.39 270 top
D159  26.54,58.42 270 top
D160  24,72.39 270 top
D161  20.19,107.95 270 top
D162  20.19,121.92 270 top
D163  15.11,107.95 270 top
D164  15.11,121.92 270 top
D165  10.03,107.95 270 top
D166  10.03,121.92 270 top
D167  68.45,58.42 270 top
D168  63.37,72.39 270 top
D169  62.1,58.42 270 top
D170  58.29,72.39 270 top
D171  55.75,58.42 270 top
D172  51.94,72.39 270 top
D173  79.88,156.21 270 top
D174  86.23,156.21 270 top
D175  50.67,58.42 270 top
D176  46.86,72.39 270 top
D177  45.59,58.42 270 top
D178  40.51,72.39 270 top
D179  39.24,58.42 270 top
D180  35.43,72.39 270 top
D181  32.89,58.42 270 top
D182  29.08,72.39 270 top
D183  24,107.95 270 top
D184  24,121.92 270 top
D185  115.44,171.45 270 top
D186  121.79,171.45 270 top
D187  128.14,171.45 270 top
D188  134.49,171.45 270 top
D189  149.73,58.42 270 top
D190  95.12,58.42 270 top
D191  17.65,58.42 270 top
D192  91.31,58.42 270 top
D193  31.62,185.42 270 top
D194  117.98,58.42 270 top
D196  131.95,156.21 270 top
E1  102.74,187.96 270 top
Q1  81.15,180.34 90 top
Q2  83.69,170.18 270 top
Q3  88.77,180.34 90 top
R1  115.44,137.16 90 top
R2  115.44,121.92 90 top
R3  138.3,87.63 90 top
R4  139.57,58.42 90 top
R5  128.14,137.16 90 top
R6  128.14,121.92 90 top
R7  121.79,137.16 90 top
R8  121.79,121.92 90 top
R9  110.36,137.16 90 top
R10  110.36,121.92 90 top
R11  104.01,137.16 90 top
R12  104.01,121.92 90 top
R13  98.93,137.16 90 top
R14  98.93,121.92 90 top
R15  92.58,137.16 90 top
R16  92.58,121.92 90 top
R17  223.39,185.42 90 top
R18  223.39,171.45 90 top
R19  234.82,137.16 90 top
R20  234.82,121.92 90 top
R21  227.2,185.42 90 top
R22  227.2,171.45 90 top
R23  219.58,185.42 90 top
R24  219.58,171.45 90 top
R25  228.47,137.16 90 top
R26  228.47,121.92 90 top
R27  191.64,156.21 270 top
R28  186.56,156.21 90 top
R29  138.3,137.16 90 top
R30  138.3,121.92 90 top
R31  143.38,185.42 90 top
R32  139.57,185.42 90 top
R33  257.68,137.16 90 top
R34  247.52,185.42 90 top
R35  242.44,185.42 90 top
R36  246.25,137.16 90 top
R37  257.68,185.42 90 top
R38  251.33,185.42 90 top
R39  251.33,137.16 90 top
R40  209.42,185.42 90 top
R41  197.99,137.16 90 top
R42  192.91,137.16 90 top
R43  187.83,137.16 90 top
R44  184.02,137.16 90 top
R45  72.26,137.16 90 top
R46  63.37,137.16 90 top
R47  58.29,137.16 90 top
R48  53.21,137.16 90 top
R49  46.86,137.16 90 top
R50  40.51,137.16 90 top
R51  35.43,137.16 90 top
R52  29.08,137.16 90 top
R53  206.88,121.92 90 top
R54  39.24,185.42 90 top
R55  49.4,185.42 90 top
R56  239.9,137.16 90 top
R57  222.12,137.16 90 top
R58  217.04,137.16 90 top
R59  213.23,185.42 90 top
R60  210.69,137.16 90 top
R61  151,137.16 90 top
R62  159.89,87.63 90 top
R63  145.92,137.16 90 top
R64  153.54,87.63 90 top
R65  17.65,87.63 90 top
R66  11.3,87.63 90 top
R67  6.22,87.63 90 top
R68  4.95,137.16 90 top
R69  152.27,171.45 90 top
R70  55.75,156.21 90 top
R71  112.9,158.75 270 top
R72  107.82,158.75 270 top
R73  104.01,158.75 270 top
R74  76.07,137.16 270 top
R75  232.28,185.42 90 top
R76  242.44,87.63 90 top
R77  236.09,87.63 90 top
R78  229.74,87.63 90 top
R79  237.36,185.42 90 top
R80  205.61,185.42 90 top
R81  177.67,137.16 90 top
R82  173.86,137.16 90 top
R83  164.97,137.16 90 top
R84  190.37,87.63 90 top
R85  185.29,87.63 90 top
R86  177.67,87.63 90 top
R87  172.59,87.63 90 top
R88  200.53,87.63 90 top
R89  194.18,87.63 90 top
R90  178.94,156.21 270 top
R91  158.62,137.16 90 top
R92  166.24,87.63 90 top
R93  131.95,87.63 90 top
R94  126.87,87.63 90 top
R95  120.52,87.63 90 top
R96  143.38,87.63 90 top
R97  97.66,87.63 90 top
R98  81.15,137.16 90 top
R99  87.5,137.16 90 top
R100  86.23,87.63 90 top
R101  81.15,87.63 90 top
R102  109.09,87.63 90 top
R103  102.74,87.63 90 top
R104  24,87.63 90 top
R105  20.19,137.16 90 top
R106  15.11,137.16 90 top
R107  10.03,137.16 90 top
R108  63.37,87.63 90 top
R109  58.29,87.63 90 top
R110  51.94,87.63 90 top
R111  83.69,156.21 270 top
R112  46.86,87.63 90 top
R113  40.51,87.63 90 top
R114  35.43,87.63 90 top
R115  29.08,87.63 90 top
R116  24,137.16 90 top
R117  69.72,87.63 90 top
R118  70.99,158.75 270 top
R119  144.65,33.02 90 top
R120  119.25,33.02 90 top
R121  91.31,33.02 90 top
R122  87.5,33.02 90 top
R123  13.84,31.75 90 top
R124  10.03,31.75 90 top
R125  92.58,87.63 90 top
R126  114.17,87.63 90 top
R127  84.96,35.56 90 top
R128  106.55,34.29 90 top
R129  129.41,185.42 90 top
T1  69.72,189.23 270 top
U$1  -0.13,0 0 top
U$2  -0.13,0 0 top

### Tracks (layer width: path | path; a pad name or v marks a point on that pad's centre or on a via)
!BRK_CYCLE  (3 unrouted)
!BRK_D_CTL  (3 unrouted)
!BRK_IN_PROG  (3 unrouted)
!BUS_STROBE  (3 unrouted)
!C0  (3 unrouted)
!C1  (3 unrouted)
!C2  (3 unrouted)
!CPMA_DISABL  (3 unrouted)
!D  (3 unrouted)
!DATA0  (3 unrouted)
!DATA1  (3 unrouted)
!DATA2  (3 unrouted)
!DATA3  (3 unrouted)
!DATA4  (3 unrouted)
!DATA5  (3 unrouted)
!DATA6  (3 unrouted)
!DATA7  (3 unrouted)
!DATA8  (3 unrouted)
!DATA9  (2 unrouted)
  Top 0.813: D88.C D89.A
!DATA10  (3 unrouted)
!DATA11  (3 unrouted)
!E  (3 unrouted)
!EMA0  (3 unrouted)
!EMA1  (3 unrouted)
!EMA2  (3 unrouted)
!F  (via drill 0.81)  (3 unrouted)
  Top 0.813: D52.C 45.59,107.95 129.41,107.95 v135.76,113.03
!F_SET  (3 unrouted)
!IND1  (3 unrouted)
!IND2  (3 unrouted)
!INT_REQ  (3 unrouted)
!INT_STROBE  (2 unrouted)
!INTERNAL_IO  (3 unrouted)
!IR0  (3 unrouted)
!IR1  (3 unrouted)
!IR2  (3 unrouted)
!KEY_CTL  (3 unrouted)
!LA_ENABLE  (3 unrouted)
!LINK  (3 unrouted)
!LINK_DATA  (3 unrouted)
!LINK_LOAD  (3 unrouted)
!MA0  (3 unrouted)
!MA1  (3 unrouted)
!MA2  (3 unrouted)
!MA3  (3 unrouted)
!MA4  (3 unrouted)
!MA5  (3 unrouted)
!MA6  (3 unrouted)
!MA7  (3 unrouted)
!MA8  (3 unrouted)
!MA9  (3 unrouted)
!MA10  (3 unrouted)
!MA11  (3 unrouted)
!MAMS_L_CTL  (3 unrouted)
!MD0  (3 unrouted)
!MD1  (3 unrouted)
!MD2  (3 unrouted)
!MD3  (3 unrouted)
!MD4  (3 unrouted)
!MD5  (3 unrouted)
!MD6  (3 unrouted)
!MD7  (3 unrouted)
!MD8  (2 unrouted)
  Top 0.813: D176.A D175.C
!MD9  (3 unrouted)
!MD10  (2 unrouted)
  Top 0.813: D180.A D179.C
!MD11  (2 unrouted)
  Top 0.813: D181.C D182.A
!MEM_DIR_IN  (3 unrouted)
!MEM_START  (3 unrouted)
!MS_IR_DISABL  (3 unrouted)
!NOT_LST_XFR  (3 unrouted)
!OVERFLOW  (3 unrouted)
!PAUSE  (3 unrouted)
!ROM_ADDR  (3 unrouted)
!RUN  (1 unrouted)
!SKIP  (3 unrouted)
!STOP  (4 unrouted)
!SW  (3 unrouted)
!TP2  (2 unrouted)
!TP4  (2 unrouted)
!TS1  (3 unrouted)
!TS2  (3 unrouted)
!TS3  (3 unrouted)
!TS4  (3 unrouted)
!USER_MODE  (3 unrouted)
+3V0  (3 unrouted)
+15V  (21 unrouted)
  Top 0.813: C21.1 159.89,190.5 R80.2 208.15,187.96 229.74,187.96 R75.2 R79.2 | Q3.C Q1.C | 102.74,88.9 90.04,88.9 R100.2 R101.2 R117.2 R109.2 | 102.74,88.9 R103.2 | R97.2 R103.2 | R102.2 R103.2 | R96.2 143.38,88.9 | 143.38,88.9 126.87,88.9 | 126.87,88.9 102.74,88.9 | R94.2 126.87,88.9 | R94.2 R95.2 | R94.2 R93.2 | R109.2 R110.2 R112.2 R113.2 R114.2 R115.2 R104.2 | R109.2 R108.2 | 143.38,88.9 162.43,88.9 R92.2 R87.2 R86.2 R85.2 R84.2 R89.2 R88.2 R78.2 R77.2 R76.2 C13.+ | R98.2 R99.2 92.58,135.89 153.54,135.89 R91.2 | R107.2 R106.2 R105.2 R116.2
  Bottom 0.813: Q2.C 84.96,170.18 84.96,180.34 Q1.C
-15V  (7 unrouted)
  Top 0.813: R71.1 R72.1 R73.1 101.47,165.1 72.26,165.1 R118.1 | R124.1 R123.1 C14.2
GND  (via drill 0.81)  (107 unrouted)
  Top 0.813: D185.C 102.74,176.53 E1.7 | D127.A D125.A 205.61,46.99 205.61,26.67 199.26,20.32 C12.- 185.29,15.24 185.29,8.89 U$2.BC2 | D105.A D103.A D101.A 247.52,48.26 248.79,30.48 v248.79,24.13 v248.79,20.32 | D192.A D151.A D153.A D167.A D169.A D171.A D175.A D177.A | D145.A D157.A | D155.A D194.A D139.A | D80.A D133.A D123.A | D119.A D121.A | D179.A D181.A D159.A | D88.A D191.A | v44.32,180.34 D58.C | D165.A 11.3,102.87 | 11.3,102.87 D163.A D161.A D183.A D56.A D54.A D52.A D50.A D48.A D46.A D44.A D42.A D147.A D149.A D8.A D7.A D6.A D5.A D1.A D4.A D3.A D15.A D82.A D78.A D131.A D115.A D113.A D111.A D40.A | D38.A D36.A D34.A D76.A D72.A D70.A D13.A 231.65,102.87 | D18.A D30.A D24.A D64.A D10.A 231.65,102.87 | R26.1 231.65,116.84 | 231.65,116.84 R20.1 | 231.65,116.84 231.65,102.87 | R16.1 R14.1 R12.1 R10.1 R2.1 R8.1 R6.1 R30.1 | C4.2 11.3,102.87 | R24.1 R18.1 R22.1 | D141.C 157.35,168.91 148.46,168.91 | 148.46,168.91 D94.A | 148.46,168.91 144.65,168.91 142.11,166.37 142.11,160.02 143.38,158.75 143.38,153.67 C22.2 v147.19,146.05
  Bottom 0.813: C24.2 v44.32,180.34
INHIBIT  (3 unrouted)
INITIALIZE  (3 unrouted)
INT_IN_PROG  (3 unrouted)
INT_STROBE  (4 unrouted)
N$1  (1 unrouted)
N$2  (1 unrouted)
N$3  (1 unrouted)
N$4  (1 unrouted)
  Bottom 0.813: C24.1 41.78,194.31 41.78,189.23 R54.1
N$5  (1 unrouted)
N$6  (10 unrouted)
  Top 0.813: R66.2 15.11,92.71 | 15.11,92.71 R65.2 | R62.2 R64.2 134.49,100.33 17.65,100.33 15.11,97.79 15.11,92.71 | R68.2 8.13,145.41 59.56,145.41 | 59.56,145.41 131.32,145.41 137.03,138.43 143.38,138.43 R63.2 | C30.1 59.56,145.41
N$7  (via drill 0.81)  (2 unrouted)
  Top 0.813: C32.1 v121.79,180.34
N$8  (1 unrouted)
N$9  (6 unrouted)
  Top 0.813: 206.88,121.92 241.17,121.92 D25.C D31.C D19.C | 206.88,121.92 197.99,121.92 | 197.99,121.92 81.15,121.92 D43.C D45.C D47.C D49.C D51.C D53.C D55.C D57.C | R53.1 206.88,121.92 | 197.99,121.92 D35.C D37.C D39.C D41.C | D23.C D21.C | D29.C D27.C
N$10  (1 unrouted)
N$11  (1 unrouted)
N$12
  Top 0.813: D68.A D69.C
N$13  (9 unrouted)
  Top 0.813: D81.C D85.C 149.73,74.93 20.19,74.93 D87.C D89.C | D83.C D79.C 154.81,129.54 200.53,129.54 204.34,124.46 222.12,124.46 | 222.12,124.46 238.63,124.46 D65.C | D77.C D73.C D71.C 222.12,124.46
N$14  (5 unrouted)
  Top 0.813: R73.2 R72.2 R71.2
N$15  (3 unrouted)
  Bottom 0.813: D63.C R55.1
N$16  (1 unrouted)
N$17  (1 unrouted)
N$18  (1 unrouted)
N$19  (1 unrouted)
N$20  (1 unrouted)
N$21  (via drill 0.81)  (1 unrouted)
  Top 0.813: T1.10 77.34,185.42 91.31,185.42 92.58,184.15 92.58,177.8 95.12,175.26 100.2,175.26 102.74,172.72 117.98,172.72 119.89,178.44 141.48,178.44 R31.1
  Bottom 0.813: C29.1 v147.19,180.34
N$22  (1 unrouted)
N$23  (11 unrouted)
  Top 0.813: R37.2 R38.2 R34.2 R35.2 239.9,193.04 211.96,193.04 R40.2 206.88,193.04 147.19,193.04 R32.1 | R52.2 R51.2 R50.2 R49.2 R48.2 R47.2 R46.2 R45.2 74.17,144.15 129.41,144.15 134.49,137.16 152.27,137.16
N$24  (1 unrouted)
N$25  (9 unrouted)
  Top 0.813: D102.C D104.C D106.C D126.C D128.C D118.C D120.C D122.C D124.C D134.C 163.7,80.01 134.49,80.01 D136.C D138.C D140.C | D108.C D100.C 230.38,178.44 211.96,178.44 211.33,177.16 211.33,174.62 210.69,173.99 206.88,173.99 205.61,175.26 D110.C 195.45,172.72 189.1,163.83 173.86,163.83 D130.C
N$26  (1 unrouted)
N$27  (1 unrouted)
N$28  (via drill 0.81)  (8 unrouted)
  Top 0.813: 69.72,77.47 D168.C D170.C D172.C D176.C | 69.72,77.47 R117.1 | 69.72,77.47 D154.C D152.C D146.C D158.C D156.C v114.17,77.47 | D166.C D164.C D162.C D184.C 26.54,129.54 78.61,129.54 D148.C D150.C | D160.C 20.19,81.28 20.19,95.25 C4.1
N$30  (via drill 0.81)
  other vias: 82.42,175.26
N$31  (via drill 0.81)
  other vias: 90.04,175.26
N$32  (via drill 0.81)
  other vias: 90.04,172.72
N$33  (via drill 0.81)
  other vias: 90.04,170.18
N$34  (via drill 0.81)
  other vias: 90.04,167.64
N$35
  Top 0.813: U$2.AA1 261.49,8.89 261.49,17.78 264.03,22.86 264.03,194.31 256.41,200.66 236.09,204.47 59.56,204.47 R55.2
POWER_OK  (4 unrouted)
PULSE_LA  (3 unrouted)
RES1  (3 unrouted)
RES2  (3 unrouted)
RETURN  (3 unrouted)
SOURCE  (3 unrouted)
STROBE  (3 unrouted)
TP1  (3 unrouted)
TP2  (4 unrouted)
TP3  (3 unrouted)
TP4  (4 unrouted)
VCC  (via drill 0.81)  (26 unrouted)
  Top 0.813: R23.2 R17.2 R21.2 | R125.2 95.12,95.25 114.17,95.25 | 114.17,95.25 R126.2 | R3.2 135.76,95.25 114.17,95.25 | R15.2 R13.2 R11.2 R9.2 R1.2 R7.2 R5.2 | C12.+ v191.64,34.29 v191.64,31.75
  Bottom 0.813: D62.C D63.A 50.67,177.8 39.24,177.8 36.7,180.34 36.7,182.88 R54.2
WRITE  (3 unrouted)

### Text on the board
Bottom: BUS LOADS M8320D